# EAGLE design RasPi-BplusHAT (EAGLE 8.7.0)
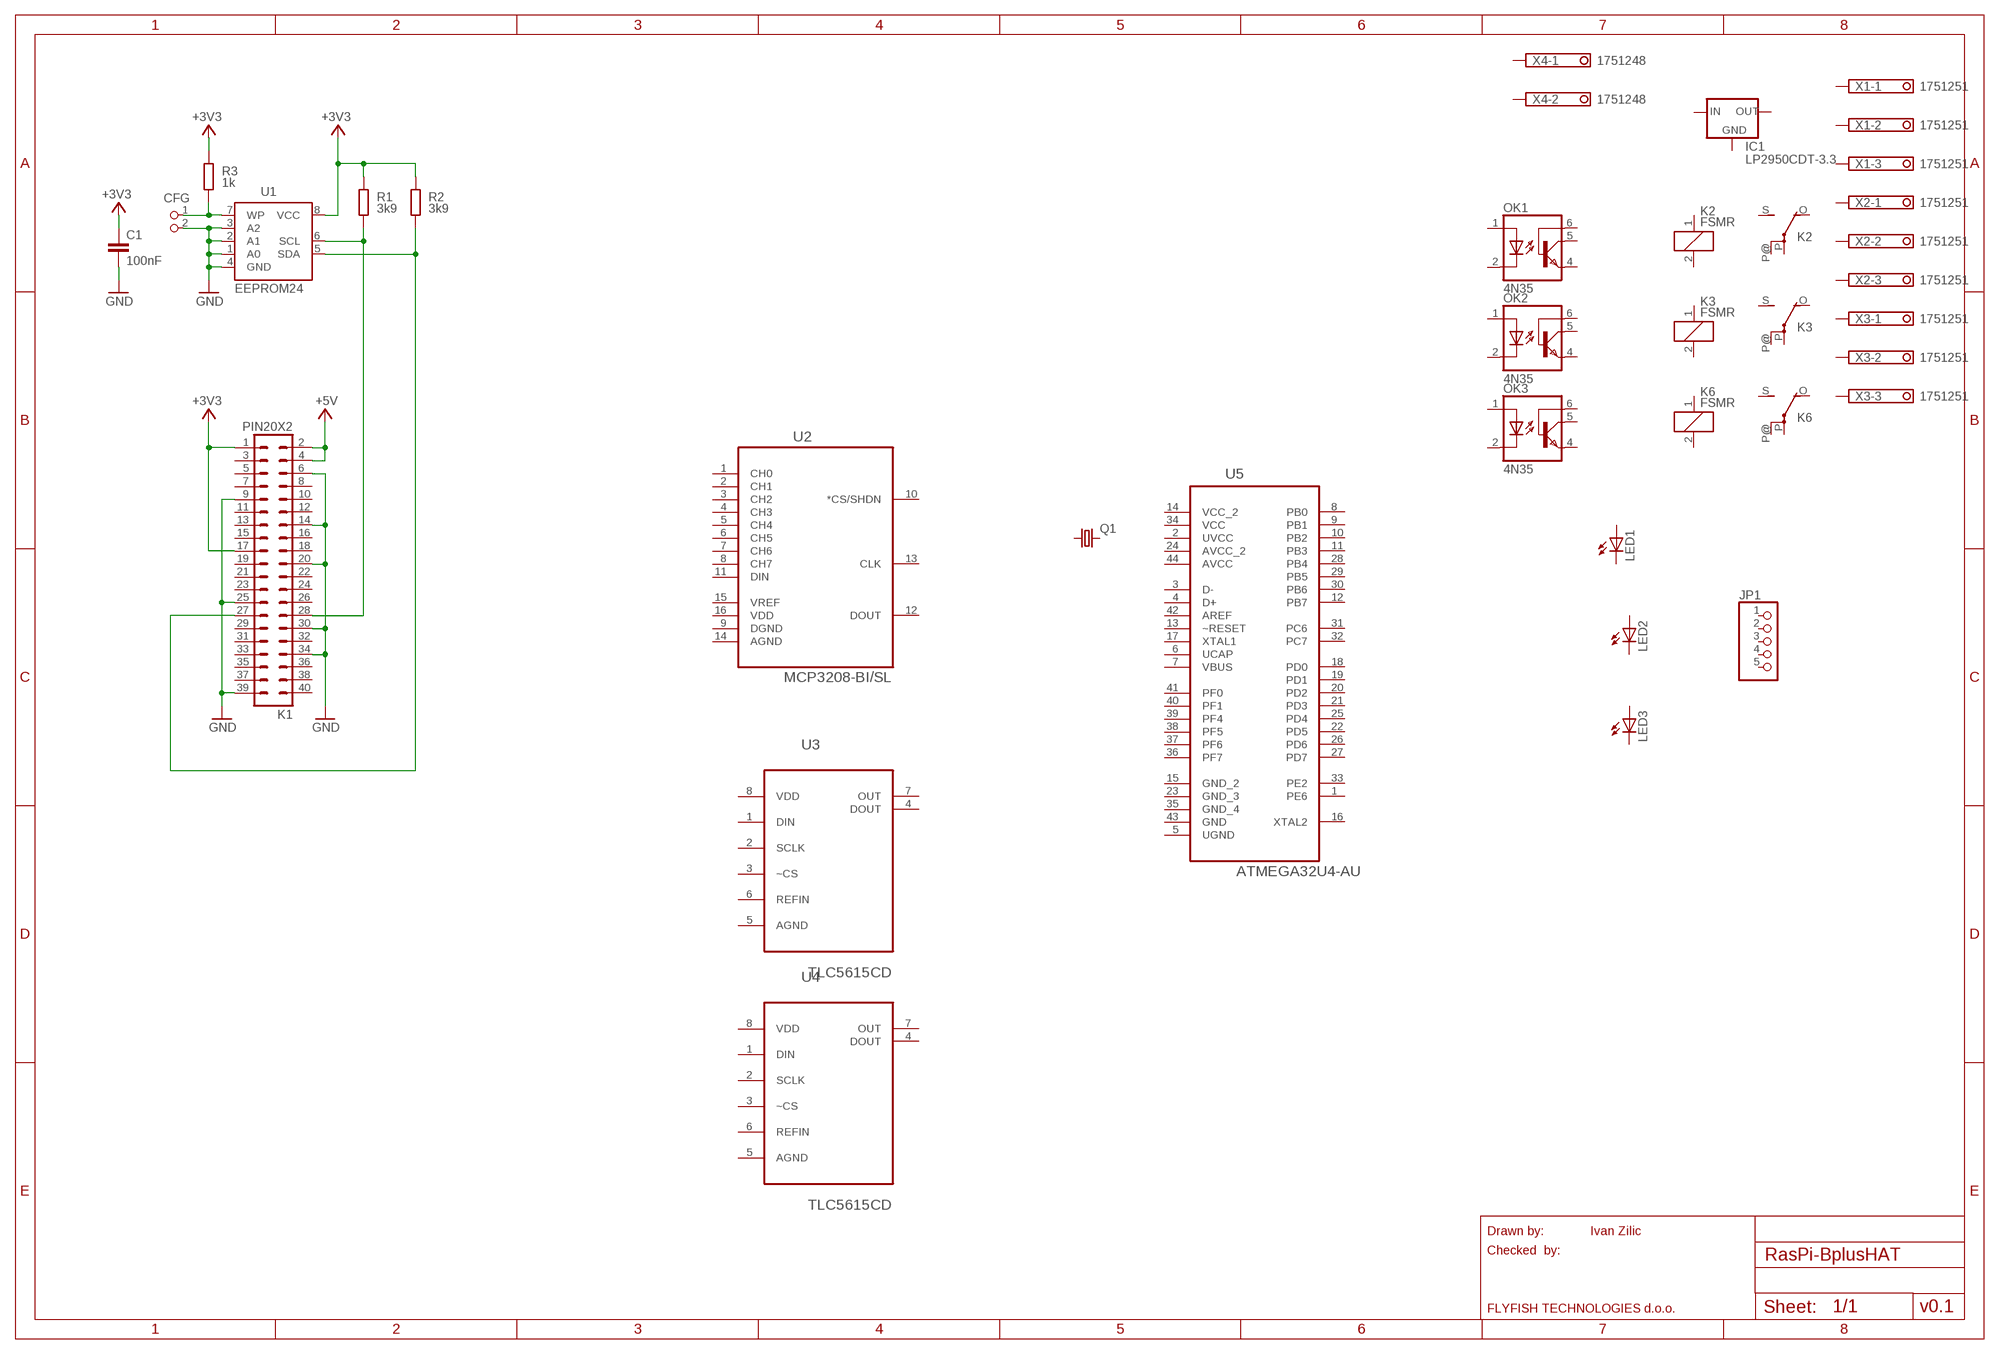
[diagram p0: schematic, sheet 1]

## Parts
C1  100nF  C-EUC0805K  [C0805K]
CFG  PIN2_100  [PIN_W_2]
IC1  LP2950CDT-3.3  [DPACK]
JP1  PINHD-1X55X2MM  [1_05X2MM]
K1  PIN20X2  [PIN_20X2]
K2  FSMR  [FSMR]
K3  FSMR  [FSMR]
K6  FSMR  [FSMR]
LED1  LEDCHIPLED_1206  [CHIPLED_1206]
LED2  LEDCHIPLED_1206  [CHIPLED_1206]
LED3  LEDCHIPLED_1206  [CHIPLED_1206]
OK1  4N35  [DIL06]
OK2  4N35  [DIL06]
OK3  4N35  [DIL06]
Q1  CRYSTALHC49UP  [HC49UP]
R1  3k9  R-EU_M0805  [M0805]
R2  3k9  R-EU_M0805  [M0805]
R3  1k  R-EU_M0805  [M0805]
U1  EEPROM24  [SOIC8]
U2  MCP3208-BI/SL  [SOIC127P600X175-16N]
U3  TLC5615CD  [SOIC127P600X175-8N]
U4  TLC5615CD  [SOIC127P600X175-8N]
U5  ATMEGA32U4-AU  [QFP80P1200X1200X120-44N]
X1  1751251  [1751251]
X2  1751251  [1751251]
X3  1751251  [1751251]
X4  1751248  [1751248]

## Nets
+3V3: C1.1 K1.1 K1.17 R1.2 R2.2 R3.2 U1.8(VCC)
+5V: K1.2 K1.4
GND: C1.2 CFG.2 K1.6 K1.9 K1.14 K1.20 K1.25 K1.30 K1.34 K1.39 U1.1(A0) U1.2(A1) U1.3(A2) U1.4(GND)
N$1: K1.28 R1.1 U1.6(SCL)
N$2: K1.27 R2.1 U1.5(SDA)
N$3: CFG.1 R3.1 U1.7(WP)
Unconnected: IC1.1(IN) IC1.3(OUT) IC1.4(GND) JP1.1 JP1.2 JP1.3 JP1.4 JP1.5 K1.3 K1.5 K1.7 K1.8 K1.10 K1.11 K1.12 K1.13 K1.15 K1.16 K1.18 K1.19 K1.21 K1.22 K1.23 K1.24 K1.26 K1.29 K1.31 K1.32 K1.33 K1.35 K1.36 K1.37 K1.38 K1.40 K2.1 K2.2 K2.O(2:O) K2.P(2:P) K2.P@(2:P) K2.S(2:S) K3.1 K3.2 K3.O(2:O) K3.P(2:P) K3.P@(2:P) K3.S(2:S) K6.1 K6.2 K6.O(2:O) K6.P(2:P) K6.P@(2:P) K6.S(2:S) LED1.A LED1.C LED2.A LED2.C LED3.A LED3.C OK1.1(A) OK1.2(C) OK1.4(EMI) OK1.5(COL) OK1.6(BAS) OK2.1(A) OK2.2(C) OK2.4(EMI) OK2.5(COL) OK2.6(BAS) OK3.1(A) OK3.2(C) OK3.4(EMI) OK3.5(COL) OK3.6(BAS) Q1.1 Q1.2 U2.1(CH0) U2.2(CH1) U2.3(CH2) U2.4(CH3) U2.5(CH4) U2.6(CH5) U2.7(CH6) U2.8(CH7) U2.9(DGND) U2.10(*CS/SHDN) U2.11(DIN) U2.12(DOUT) U2.13(CLK) U2.14(AGND) U2.15(VREF) U3.1(DIN) U3.2(SCLK) U3.3(~CS) U3.4(DOUT) U3.5(AGND) U3.6(REFIN) U3.7(OUT) U4.1(DIN) U4.2(SCLK) U4.3(~CS) U4.4(DOUT) U4.5(AGND) U4.6(REFIN) U4.7(OUT) U5.1(PE6) U5.3(D-) U5.4(D+) U5.5(UGND) U5.7(VBUS) U5.8(PB0) U5.9(PB1) U5.10(PB2) U5.11(PB3) U5.12(PB7) U5.13(~RESET) U5.15(GND_2) U5.16(XTAL2) U5.17(XTAL1) U5.18(PD0) U5.19(PD1) U5.20(PD2) U5.21(PD3) U5.22(PD5) U5.23(GND_3) U5.25(PD4) U5.26(PD6) U5.27(PD7) U5.28(PB4) U5.29(PB5) U5.30(PB6) U5.31(PC6) U5.32(PC7) U5.33(PE2) U5.35(GND_4) U5.36(PF7) U5.37(PF6) U5.38(PF5) U5.39(PF4) U5.40(PF1) U5.41(PF0) U5.42(AREF) U5.43(GND) X1.1 X1.2 X1.3 X2.1 X2.2 X2.3 X3.1 X3.2 X3.3 X4.1 X4.2

## Notes on the sheet
- Drawn by: | Ivan Zilic
- Checked  by:
- FLYFISH TECHNOLOGIES d.o.o. | v0.1

## Power pins joined to a net without a drawn wire
AVCC: U5.44(AVCC)
AVCC_2: U5.24(AVCC_2)
UCAP: U5.6(UCAP)
UVCC: U5.2(UVCC)
VCC: U5.34(VCC)
VCC_2: U5.14(VCC_2)
VDD: U2.16(VDD) U3.8(VDD) U4.8(VDD)

## Library data of the parts
C1 = resistor:C-EU: CAPACITOR, European symbol; DIELECTRIC: X7R
CFG = FLYFISH:PIN2
IC1 = v-reg:LP2950?*: Source: http://cache.national.com/ds/LP/LP2950.pdf
JP1 = pinhead:PINHD-1X5: PIN HEADER
K1 = FLYFISH:PIN20X2
K2 K3 K6 = relay:FSMR: RELAY 1 x switch, same as FBR21D/H, Fujitsu; OC_FARNELL: unknown; OC_NEWARK: unknown
LED1-LED3 = led:LED: LED OSRAM: - CHIPLED LG R971, LG N971, LY N971, LG Q971, LY Q971, LO R971, LY R971 LH N974, LH R974 LS Q976, LO Q976, LY Q976 LO Q996 - Hyper CHIPLED LW Q18S LB Q993, LB Q99A, LB R99A - SideLED LS A670, LO A670, LY A670, LG A670, LP A670 LB A673, LV A673, LT A673, LW A673 LH A674 LY A675 LS A676, LA A676, LO A676, LY A676, LW A676 LS A679, LY A679, LG A679 - Hyper Micro SIDELED® LS Y876, LA Y876, LO Y876, LY Y876 LT Y87S - SmartLED LW L88C, LW L88S LB L89C, LB L89S, LG L890 LS L89K, LO L89K, LY L89K LS L896, LA L896, LO L896, LY L896 - TOPLED LS T670, LO T670, LY T670, LG T670, LP T670 LSG T670, LSP T670, LSY T670, LOP T670, LYG T670 LG T671, LOG T671, LSG T671 LB T673, LV T673, LT T673, LW T673 LH T674 LS T676, LA T676, LO T676, LY T676, LB T676, LH T676, LSB T676, LW T676 LB T67C, LV T67C, LT T67C, LS T67K, LO T67K, LY T67K, LW E67C LS E67B, LA E67B, LO E67B, LY E67B, LB E67C, LV E67C, LT E67C LW T67C LS T679, LY T679, LG T679 LS T770, LO T770, LY T770, LG T770, LP T770 LB T773, LV T773, LT T773, LW T773 LH T774 LS E675, LA E675, LY E675, LS T675 LS T776, LA T776, LO T776, LY T776, LB T776 LHGB T686 LT T68C, LB T68C - Hyper Mini TOPLED® LB M676 - Mini TOPLED Santana® LG M470 LS M47K, LO M47K, LY M47K Source: http://www.osram.convergy.de LUXEON: - LUMILED® LXK2-PW12-R00, LXK2-PW12-S00, LXK2-PW14-U00, LXK2-PW14-V00 LXK2-PM12-R00, LXK2-PM12-S00, LXK2-PM14-U00 LXK2-PE12-Q00, LXK2-PE12-R00, LXK2-PE12-S00, LXK2-PE14-T00, LXK2-PE14-U00 LXK2-PB12-K00, LXK2-PB12-L00, LXK2-PB12-M00, LXK2-PB14-N00, LXK2-PB14-P00, LXK2-PB14-Q00 LXK2-PR12-L00, LXK2-PR12-M00, LXK2-PR14-Q00, LXK2-PR14-R00 LXK2-PD12-Q00, LXK2-PD12-R00, LXK2-PD12-S00 LXK2-PH12-R00, LXK2-PH12-S00 LXK2-PL12-P00, LXK2-PL12-Q00, LXK2-PL12-R00 Source: www.luxeon.com KINGBRIGHT: KA-3528ASYC Source: www.kingbright.com
OK1-OK3 = optocoupler:4N35: MOTOROLA OPTO COUPLER; MF: FAIRCHILD SEMICONDUCTOR; MPN: 4N35; OC_FARNELL: 1328375; OC_NEWARK: 72K9946
Q1 = crystal:CRYSTAL: CRYSTAL; OC_FARNELL: unknown; OC_NEWARK: unknown
R1-R3 = resistor:R-EU_: RESISTOR, European symbol; TOLERANCE: 5%
U1 = FLYFISH:EEPROM24
U2 = MCP3208-BI_SL:MCP3208-BI/SL: IC, 12 ADC, SMD, 3208; AVAILABILITY: Good; DESCRIPTION: Octal Channel Single ADC SAR 100ksps 12-bit Serial Automotive 16-Pin SOIC N Tube; MF: Microchip; MP: MCP3208-BI/SL; PACKAGE: SOIC-16 Microchip; PRICE: 4.03 USD
U3 U4 = TLC5615CD:TLC5615CD: 10-BIT DIGITAL-TO-ANALOG CONVERTERS; AVAILABILITY: Unavailable; DESCRIPTION: 10-Bit, 12.5 us DAC, Serial Input, Low Power 8-SOIC 0 to 70; MF: Texas Instruments; MP: TLC5615CD; PACKAGE: SOIC-8 Texas Instruments; PRICE: None
U5 = ATMEGA32U4-AU:ATMEGA32U4-AU: 8-bit Microcontroller with ISP Flash and USB Controller; AVAILABILITY: Good; DESCRIPTION: MCU 8-bit ATmega AVR RISC 32KB Flash 3.3V/5V 44-Pin TQFP; MF: Microchip; MP: ATMEGA32U4-AU; PACKAGE: TQFP-44 Microchip; PRICE: 4.05 USD
X1-X3 = con-phoenix-350:1751251: MKDS 1/ 3-3,5 Printklemme Nennstrom: 10 A Bemessungsspannung: 160 V Raster: 3,5 mm Polzahl: 3 Montageart: Löten Anschlussart: Schraubanschluss Anschlussrichtung vom Leiter zur Platine: 0° Source: http://eshop.phoenixcontact.com .. 1751251.pdf; OC_FARNELL: unknown; OC_NEWARK: unknown
X4 = con-phoenix-350:1751248: MKDS 1/ 2-3,5 Printklemme Nennstrom: 10 A Bemessungsspannung: 160 V Raster: 3,5 mm Polzahl: 2 Montageart: Löten Anschlussart: Schraubanschluss Anschlussrichtung vom Leiter zur Platine: 0° Source: http://eshop.phoenixcontact.com .. 1751248.pdf; OC_FARNELL: unknown; OC_NEWARK: unknown

## Board
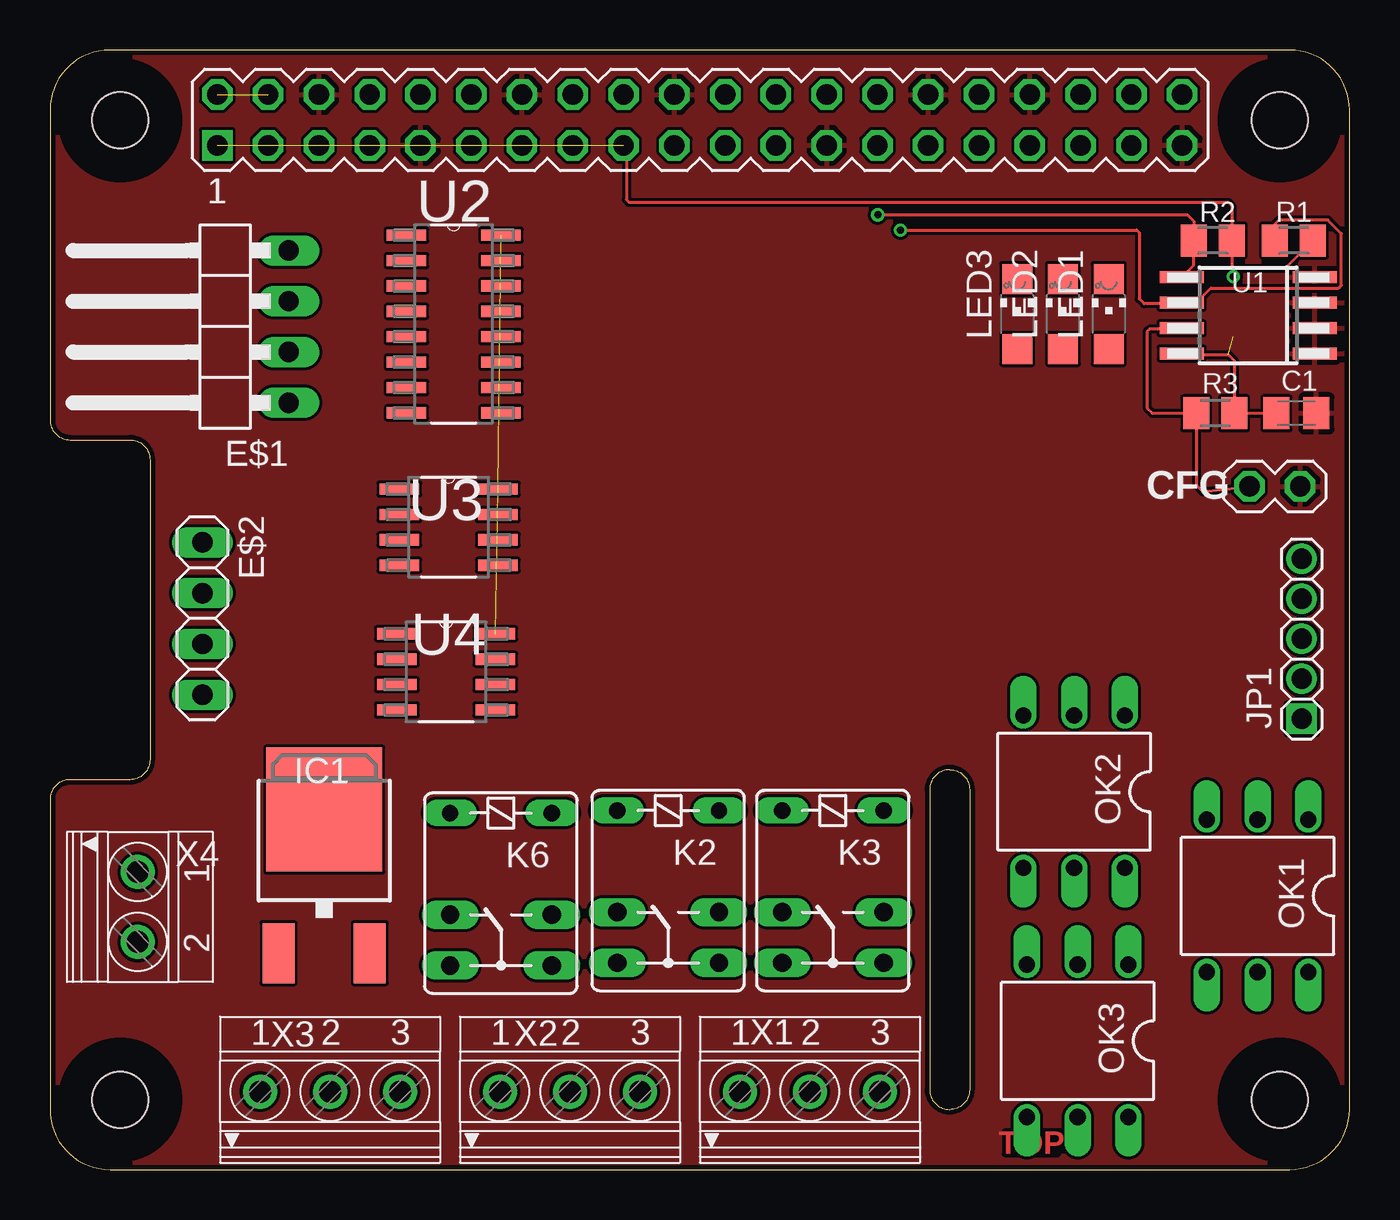
[diagram p1: board, top side]
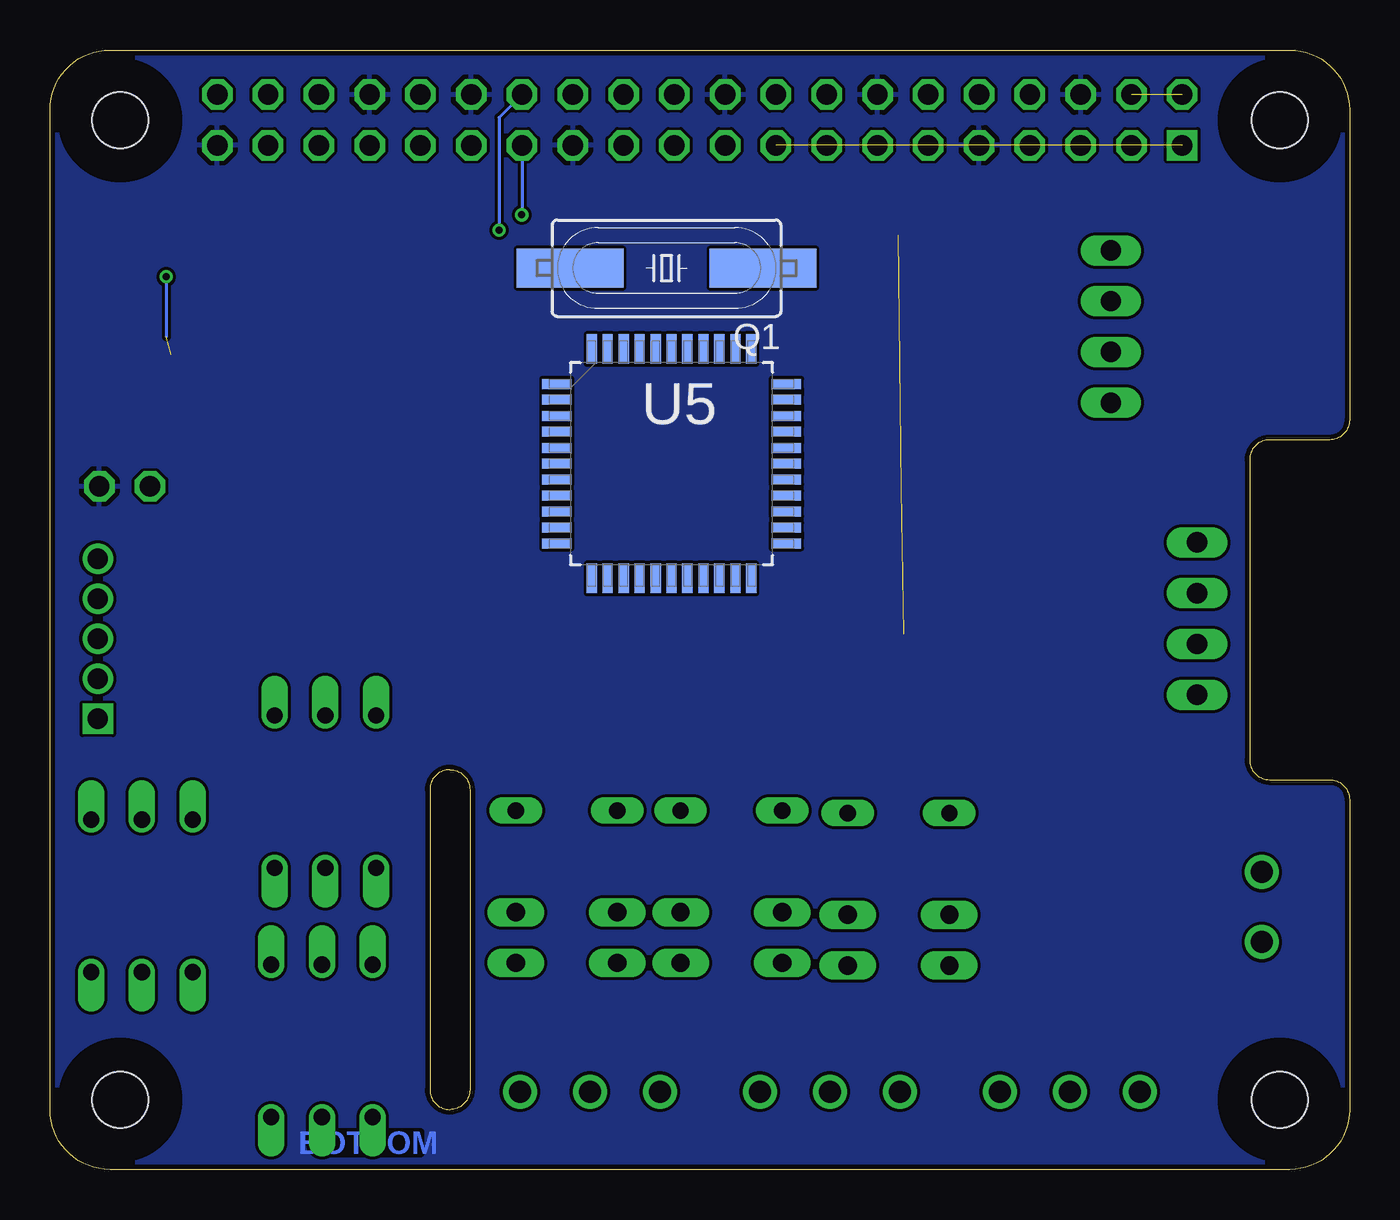
[diagram p2: board, bottom side, seen from below]

Size 65 x 56 mm. Coordinates in mm from the lower left corner, seen from the top.
Outline: 0,3 arc90 3,0 62,0 arc90 65,3 65,53 arc90 62,56 3,56 arc90 0,53 0,37.5 arc90 1,36.5 4,36.5 arc-90 5,35.5 5,20.5 arc-90 4,19.5 1,19.5 arc90 0,18.5 0,3
Outline: 44,19 44,4 arc90 45,3 arc90 46,4 46,19 arc90 45,20 arc90 44,19
Copper layers (1*16): Top 0.035mm / dielectric 1.5mm / Bottom 0.035mm
Design rules "ITEADstudio_DRC": minimum track width 6mil, minimum drill 12mil, track to track 6mil, track to pad 6mil, pad to pad 6mil, via to via 6mil, smd to smd 0mil, copper to edge 10mil, drill to drill 10mil, minimum pad ring 10mil, minimum via ring 6mil, stop-mask expansion 2mil, vias tented up to drill 100mil, thermal gap 10mil
Holes 2.8 mm at 3.5,3.5 3.5,52.5 61.5,52.5 61.5,3.5
tRestrict: area 1.9,51 to 5,54; area 60,51 to 63,54; area 60,1.9 to 63,5; area 1.9,1.9 to 5,5
bRestrict: area 1.9,1.9 to 5,5; area 1.9,51 to 5,54; area 60,1.9 to 63,5; area 60,51 to 63,54
Milling: 6 lines

### Footprints (pad centres in the part's own frame; a part is rotated, then mirrored left to right if it is on the bottom)
C0805K = smd 1.3 x 1.6: 1 -1,0; 2 1,0
PIN_W_2 = drill 1.016 octagon: 1 0,0; 2 0,-2.54
1X04/90 = drill 1.016 long: 1 -3.81,-3.81; 2 -1.27,-3.81; 3 1.27,-3.81; 4 3.81,-3.81
1X04 = drill 1.016 long: 1 -3.81,0; 2 -1.27,0; 3 1.27,0; 4 3.81,0
DPACK = smd 1.6 x 3: 1 -2.28,-4.8; 3 2.28,-4.8 | smd 5.8 x 6.2: 4 0,2.38
1_05X2MM = drill 1.016 pad 1.3 square: 1 -4,0 | drill 1.016 pad 1.3: 2 -2,0; 3 0,0; 4 2,0; 5 4,0
PIN_20X2 = drill 1.016 square: 1 -24.13,-1.27 | drill 1.016 octagon: 2 -24.13,1.27; 3 -21.59,-1.27; 4 -21.59,1.27; 5 -19.05,-1.27; 6 -19.05,1.27; 7 -16.51,-1.27; 8 -16.51,1.27; 9 -13.97,-1.27; 10 -13.97,1.27; 11 -11.43,-1.27; 12 -11.43,1.27; 13 -8.89,-1.27; 14 -8.89,1.27; 15 -6.35,-1.27; 16 -6.35,1.27; 17 -3.81,-1.27; 18 -3.81,1.27; 19 -1.27,-1.27; 20 -1.27,1.27; 21 1.27,-1.27; 22 1.27,1.27; 23 3.81,-1.27; 24 3.81,1.27; 25 6.35,-1.27; 26 6.35,1.27; 27 8.89,-1.27; 28 8.89,1.27; 29 11.43,-1.27; 30 11.43,1.27; 31 13.97,-1.27; 32 13.97,1.27; 33 16.51,-1.27; 34 16.51,1.27; 35 19.05,-1.27; 36 19.05,1.27; 37 21.59,-1.27; 38 21.59,1.27; 39 24.13,-1.27; 40 24.13,1.27
FSMR = drill 0.813 long: 1 5.08,2.54; 2 5.08,-2.54 | drill 0.914 long: O 0,2.54; P -2.54,2.54; P@ -2.54,-2.54; S 0,-2.54
CHIPLED_1206 = smd 1.5 x 1.5: A 0,-1.75; C 0,1.75
DIL06 = drill 0.813 offset: 1 -2.54,-3.81; 2 0,-3.81; 3 2.54,-3.81; 4 2.54,3.81; 5 0,3.81; 6 -2.54,3.81
HC49UP = smd 5.334 x 1.93: 1 -4.826,0; 2 4.826,0
M0805 = smd 1.3 x 1.6: 1 -0.95,0; 2 0.95,0
SOIC8 = smd 0.6 x 2.2: 1 -1.905,-3.33; 2 -0.635,-3.33; 3 0.635,-3.33; 4 1.905,-3.33; 5 1.905,3.33; 6 0.635,3.33; 7 -0.635,3.33; 8 -1.905,3.33
SOIC127P600X175-16N = smd 1.981 x 0.559: 1 -2.362,4.445; 2 -2.362,3.175; 3 -2.362,1.905; 4 -2.362,0.635; 5 -2.362,-0.635; 6 -2.362,-1.905; 7 -2.362,-3.175; 8 -2.362,-4.445; 9 2.362,-4.445; 10 2.362,-3.175; 11 2.362,-1.905; 12 2.362,-0.635; 13 2.362,0.635; 14 2.362,1.905; 15 2.362,3.175; 16 2.362,4.445
SOIC127P600X175-8N = smd 1.981 x 0.559: 1 -2.464,1.905; 2 -2.464,0.635; 3 -2.464,-0.635; 4 -2.464,-1.905; 5 2.464,-1.905; 6 2.464,-0.635; 7 2.464,0.635; 8 2.464,1.905
QFP80P1200X1200X120-44N = smd 1.473 x 0.508: 1 -5.74,3.988; 2 -5.74,3.2; 3 -5.74,2.388; 4 -5.74,1.6; 5 -5.74,0.787; 6 -5.74,0; 7 -5.74,-0.787; 8 -5.74,-1.6; 9 -5.74,-2.388; 10 -5.74,-3.2; 11 -5.74,-3.988; 23 5.74,-3.988; 24 5.74,-3.2; 25 5.74,-2.388; 26 5.74,-1.6; 27 5.74,-0.787; 28 5.74,0; 29 5.74,0.787; 30 5.74,1.6; 31 5.74,2.388; 32 5.74,3.2; 33 5.74,3.988 | smd 0.508 x 1.473: 12 -3.988,-5.74; 13 -3.2,-5.74; 14 -2.388,-5.74; 15 -1.6,-5.74; 16 -0.787,-5.74; 17 0,-5.74; 18 0.787,-5.74; 19 1.6,-5.74; 20 2.388,-5.74; 21 3.2,-5.74; 22 3.988,-5.74; 34 3.988,5.74; 35 3.2,5.74; 36 2.388,5.74; 37 1.6,5.74; 38 0.787,5.74; 39 0,5.74; 40 -0.787,5.74; 41 -1.6,5.74; 42 -2.388,5.74; 43 -3.2,5.74; 44 -3.988,5.74
1751251 = drill 1.1 pad 1.7: 1 -3.5,-0.1; 2 0,-0.1; 3 3.5,-0.1
1751248 = drill 1.1 pad 1.7: 1 -1.75,-0.1; 2 1.75,-0.1

### Placement (x,y rotation side)
C1  62.34,37.83 0 top
CFG  59.99,34.17 90 top
E$1  [1X04/90]  8.13,42.16 90 top
E$2  [1X04]  7.62,27.56 270 top
IC1  13.72,15.62 0 top
JP1  62.61,26.54 90 top
K1  32.5,52.5 0 top
K2  30.92,12.87 90 top
K3  39.16,12.87 90 top
K6  22.56,12.75 90 top
LED1  52.96,42.8 0 top
LED2  50.67,42.8 0 top
LED3  48.39,42.8 0 top
OK1  60.4,13.69 180 top
OK2  51.23,18.9 180 top
OK3  51.4,6.43 180 top
Q1  34.16,45.09 180 bottom
R1  62.22,46.47 0 top
R2  58.15,46.47 0 top
R3  58.28,37.83 0 top
U1  59.93,42.72 90 top
U2  20.19,42.29 0 top
U3  19.94,32.13 0 top
U4  19.81,24.89 0 top
U5  33.91,35.31 0 bottom
X1  38,4 0 top
X2  26,4 0 top
X3  14,4 0 top
X4  4.49,13.13 270 top

### Tracks (layer width: path | path; a pad name or v marks a point on that pad's centre or on a via)
+3V3  (via drill 0.35)  (2 unrouted)
  Top 0.152: K1.17 28.83,51.09 28.83,48.51 28.96,48.39 58.93,48.39 59.1,48.21 R2.2 59.1,45.16 59.18,45.09 | 59.18,45.09 61.78,45.09 R1.2 | U1.8 56.65,40.77 58.93,40.77 | 58.93,40.77 59.23,40.46 R3.2 C1.1 | 59.18,45.09 v59.18,44.65 | 58.93,40.77
  Bottom 0.152: v59.18,44.65 59.18,43.43 59.18,41.66
+5V  (1 unrouted)
GND
  pour Bottom: 0,3 arc90 3,0 62,0 arc90 65,3 65,53 arc90 62,56 3,56 arc90 0,53 0,37.5 arc90 1,36.5 4,36.5 arc-90 5,35.5 5,20.5 arc-90 4,19.5 1,19.5 arc90 0,18.5
  pour Top: 0,3 arc90 3,0 62,0 arc90 65,3 65,53 arc90 62,56 3,56 arc90 0,53 0,37.5 arc90 1,36.5 4,36.5 arc-90 5,35.5 5,20.5 arc-90 4,19.5 1,19.5 arc90 0,18.5
N$1  (via drill 0.35)
  Top 0.152: v42.55,46.99 54.36,46.99 54.48,46.86 54.48,43.56 54.74,43.31 56.55,43.31 U1.6 57.33,43.36 58.07,44.1 64.46,44.1 64.59,44.23 64.59,46.82 63.91,47.5 61.47,47.5 61.27,47.3 R1.1
  Bottom 0.152: K1.28 42.55,52.62 v42.55,46.99
N$2  (via drill 0.35)
  Top 0.152: v41.4,47.75 56.9,47.75 57.2,47.44 R2.1 57.2,45.23 U1.5
  Bottom 0.152: K1.27 41.39,47.76 v41.4,47.75
N$3
  Top 0.152: U1.7 56.55,42.04 54.99,42.04 54.86,41.91 54.86,38.1 55.13,37.83 R3.1 57.33,34.24 57.66,33.91 57.67,33.92 CFG.1
VDD  (2 unrouted)

### Text on the board
Top: TOP
Bottom: BOTTOM